# Altium project PCB_Invernadero.PrjPcb
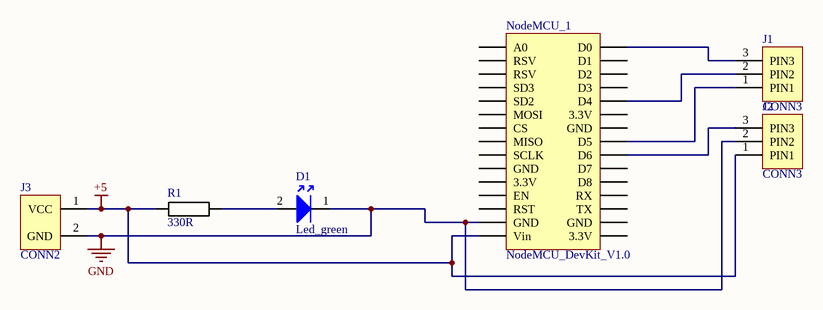
[diagram p0: PCB_Invernadero.SchDoc]
1 sheet, 6 parts. Net scope: global (net labels, ports and power ports of the same name join across sheets).
Board file: PCB_Invernadero.PcbDoc

## Sheet PCB_Invernadero.SchDoc
size A4

### Parts
D1  Led_green  [Diode_5mm_green]
J1  CONN3  [CONN3]
J2  CONN3  [CONN3]
J3  CONN2  [CONN2]
NodeMCU_1  NodeMCU_DevKit_V1.0  [NodeMCU_DevKit_V1.0]
R1  330R  [330R_P8mm_0.25W]

### Nets
+5: J2.1(PIN1) J3.1(VCC) NodeMCU_1.Vin R1.1
GND: D1.1 J2.2(PIN2) J3.2(GND) NodeMCU_1.GND
NetD1_2: D1.2 R1.2
NetJ1_1: J1.1(PIN1) NodeMCU_1.D5
NetJ1_2: J1.2(PIN2) NodeMCU_1.D4
NetJ1_3: J1.3(PIN3) NodeMCU_1.D0
NetJ2_3: J2.3(PIN3) NodeMCU_1.D6

Not connected (* = marked no-connect by the designer): NodeMCU_1 3.3V A0 CS D1 D2 D3 D7 D8 EN MISO MOSI RST RSV RX SCLK SD2 SD3 TX

### Library data of the parts
J1 J2 = Bornera_3_pin
J3 = Conector
NodeMCU_1 = NodeMCU
R1 = 330R_0.25W